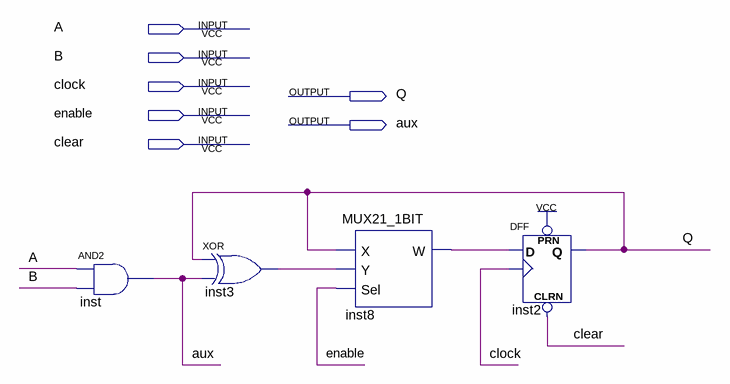
[diagram p0: schematic sheet]
// Quartus schematic AuxSomador.bdf as structural Verilog: 4 symbols, 7 pins
module AuxSomador (
  input  A,
  input  B,
  input  clock,
  input  enable,
  input  clear,
  output Q,
  output aux
);

  wire inst3_out, inst8_w;

  and inst (aux, A, B);
  xor inst3 (inst3_out, Q, aux);
  MUX21_1BIT inst8 (.X(Q), .Y(inst3_out), .Sel(enable), .W(inst8_w));
  DFF inst2 (.CLRN(clear), .CLK(clock), .D(inst8_w), .PRN(1'b1), .Q(Q));
endmodule
